# EasyEDA Pro project Hackcard.epro

# Schematic BuisnessCard
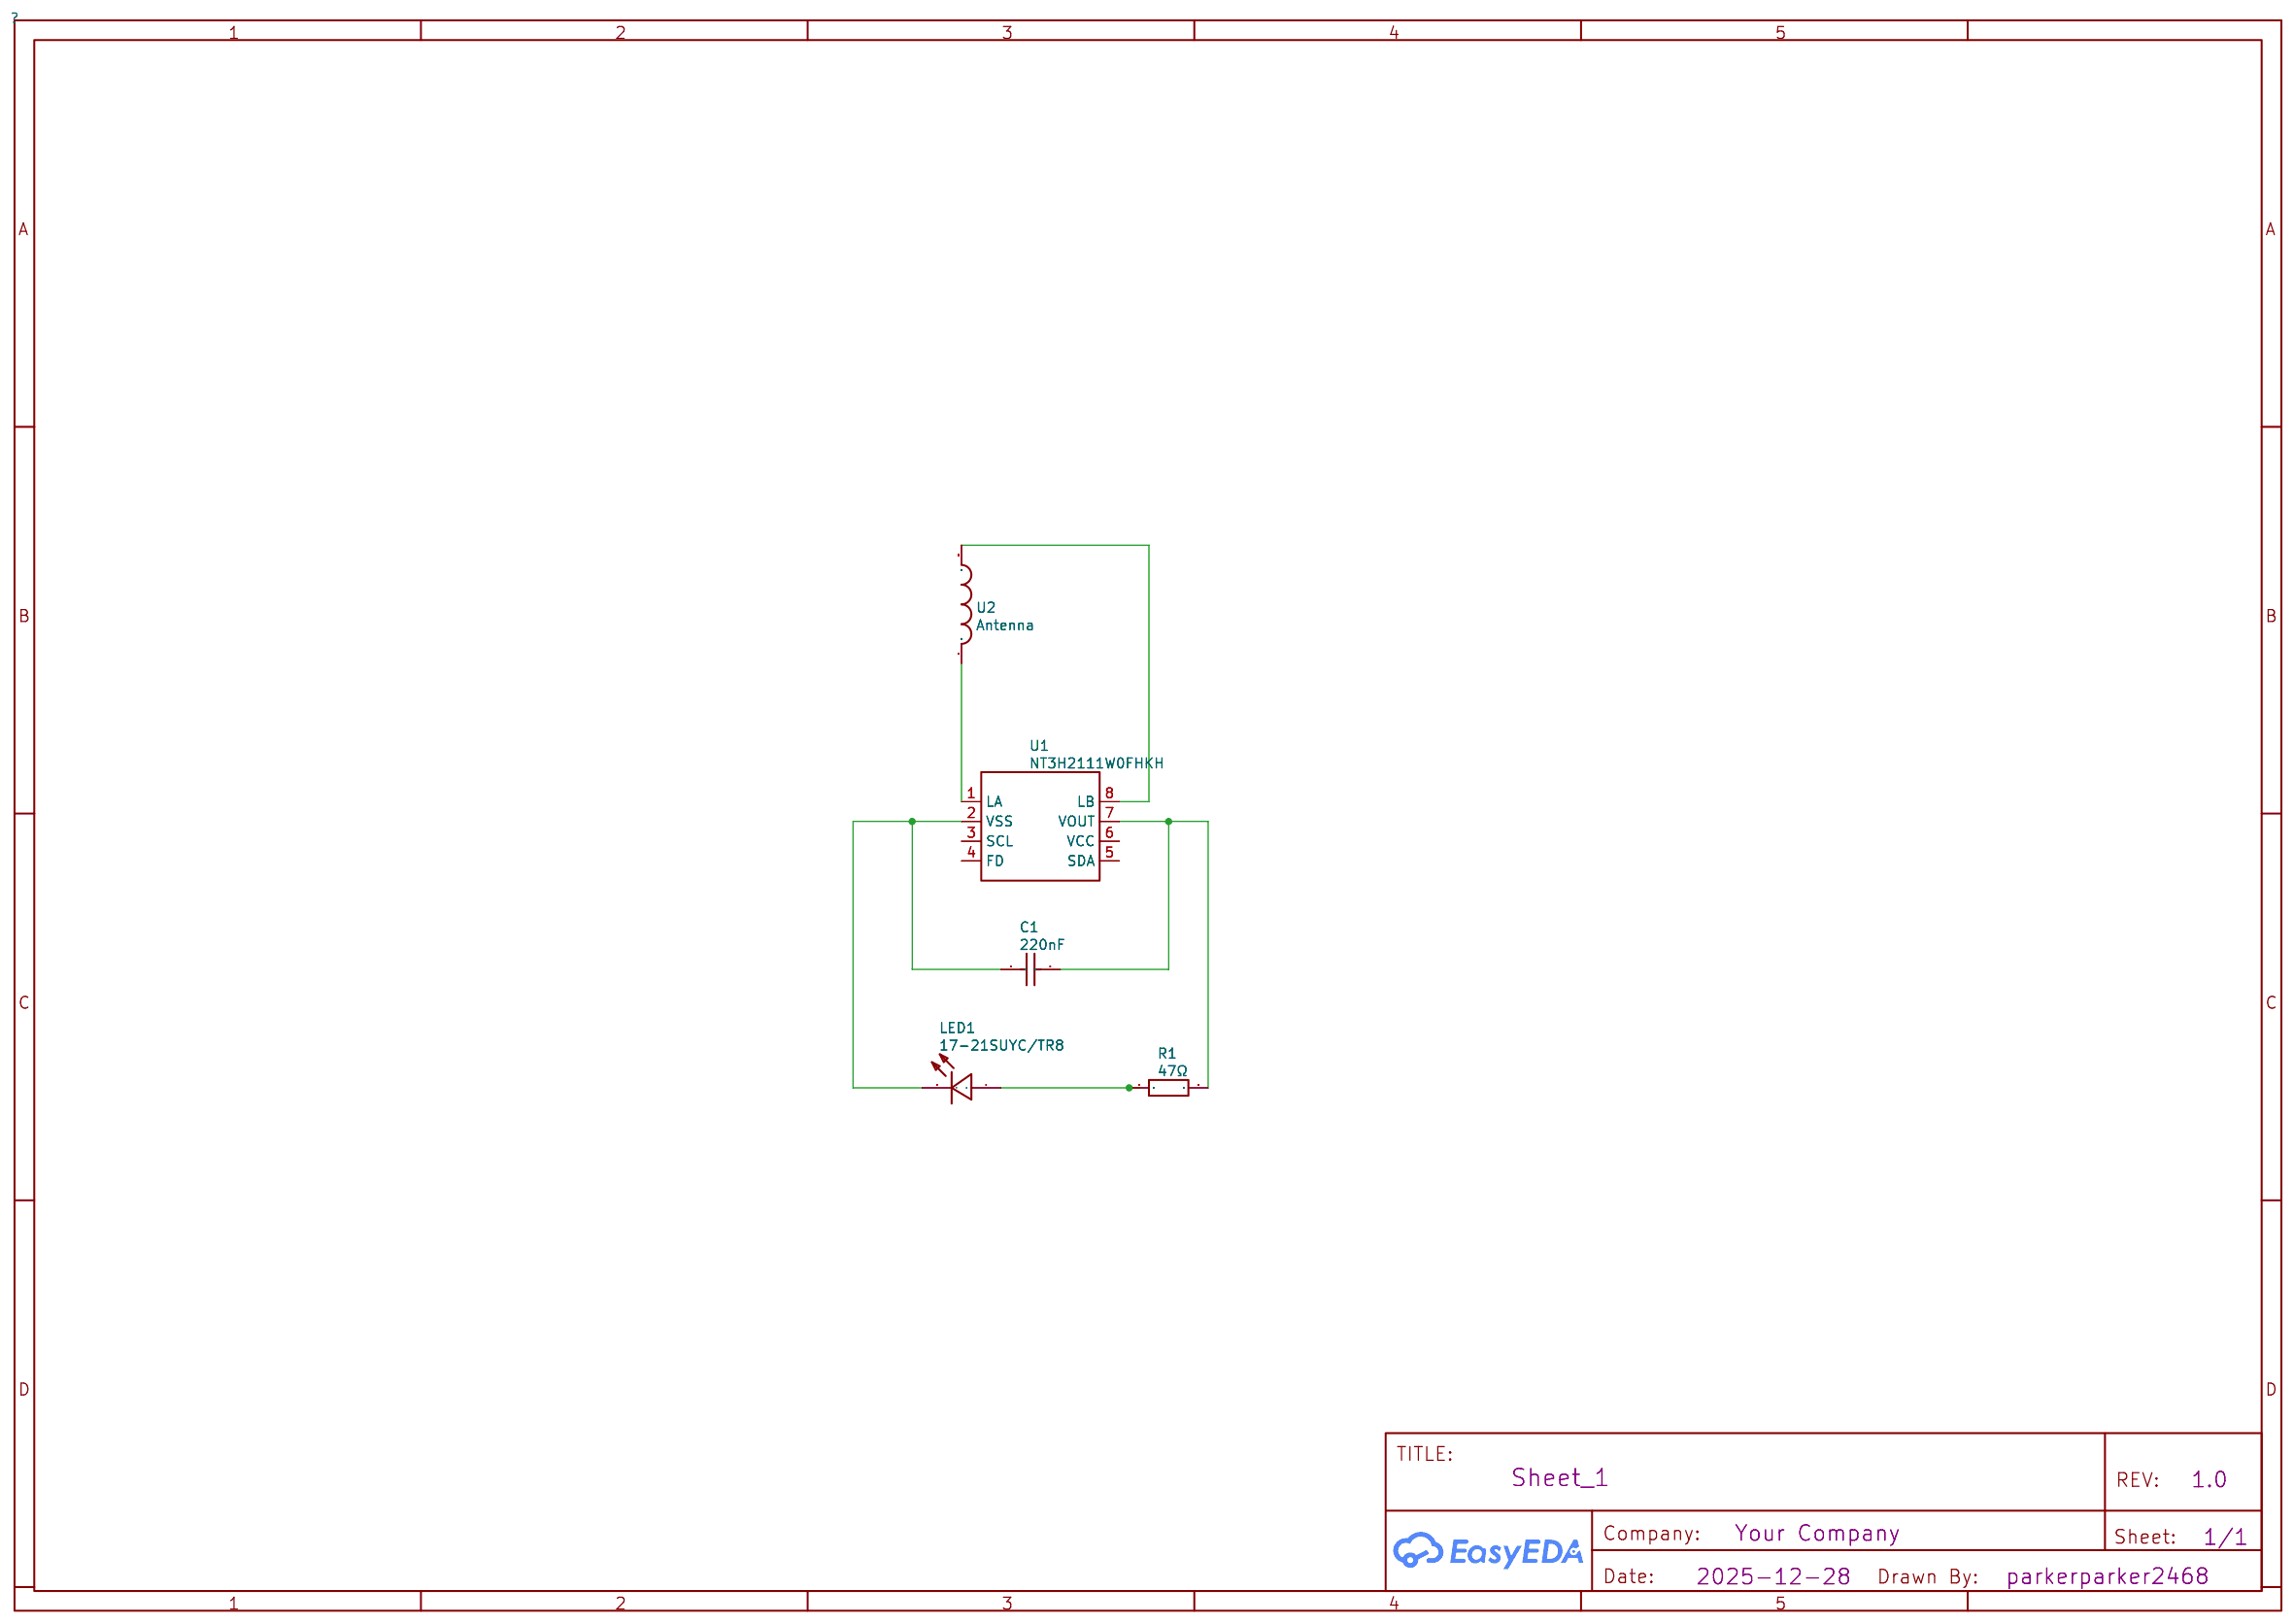
[diagram p0: schematic sheet]

## Parts
C1  220nF  [C0603]
LED1  17-21SUYC/TR8  [LED0805-R-RD]
R1  47Ω  [R0603]
U1  NT3H2111W0FHKH  [XQFN-8_L1.6-W1.6-P0.50-BL_NT3H2111W0FHKH]
U2  Antenna  [25X48MM_NFC_ANTENNA]

## Library data of the parts
C1 = 220nF: Supplier: LCSC; Manufacturer Part: CL10B224KA8NNNC; Manufacturer: SAMSUNG(三星); Supplier Part: C21120; JLCPCB Part Class: Basic Part; nameAlias: Value; spicePre: C; spiceSymbolName: CL10B224KA8NNNC
LED1 = 17-21SUYC/TR8: Supplier: LCSC; Manufacturer: KENTO; Manufacturer Part: KT-0805黄灯; Supplier Part: C2296; JLCPCB Part Class: Basic Part; spicePre: L
R1 = 47Ω: Supplier: LCSC; Manufacturer: UNI-ROYAL(厚声); Manufacturer Part: 0603WAF470JT5E; Supplier Part: C23182; JLCPCB Part Class: Basic Part; nameAlias: Value; spicePre: R; spiceSymbolName: 0603WAF470JT5E
U1 = NT3H2111W0FHKH: Supplier: LCSC; Supplier Part: C710403; Manufacturer: NXP(恩智浦); JLCPCB Part Class: Extended Part; Contributor: LCSC; spicePre: U
U2 = Antenna: Contributor: maggie.j.liu; spicePre: U

## Nets
LED1_1: LED1.1(+) R1.1
U1_1: U1.1(LA) U2.P$1
U1_2: C1.1 LED1.2(-) U1.2(VSS)
U1_7: C1.2 R1.2 U1.7(VOUT)
U1_8: U1.8(LB) U2.P$2

Not connected (* = marked no-connect by the designer): U1 3(SCL) 4(FD) 5(SDA) 6(VCC)

# Board PCB_BuisnessCard
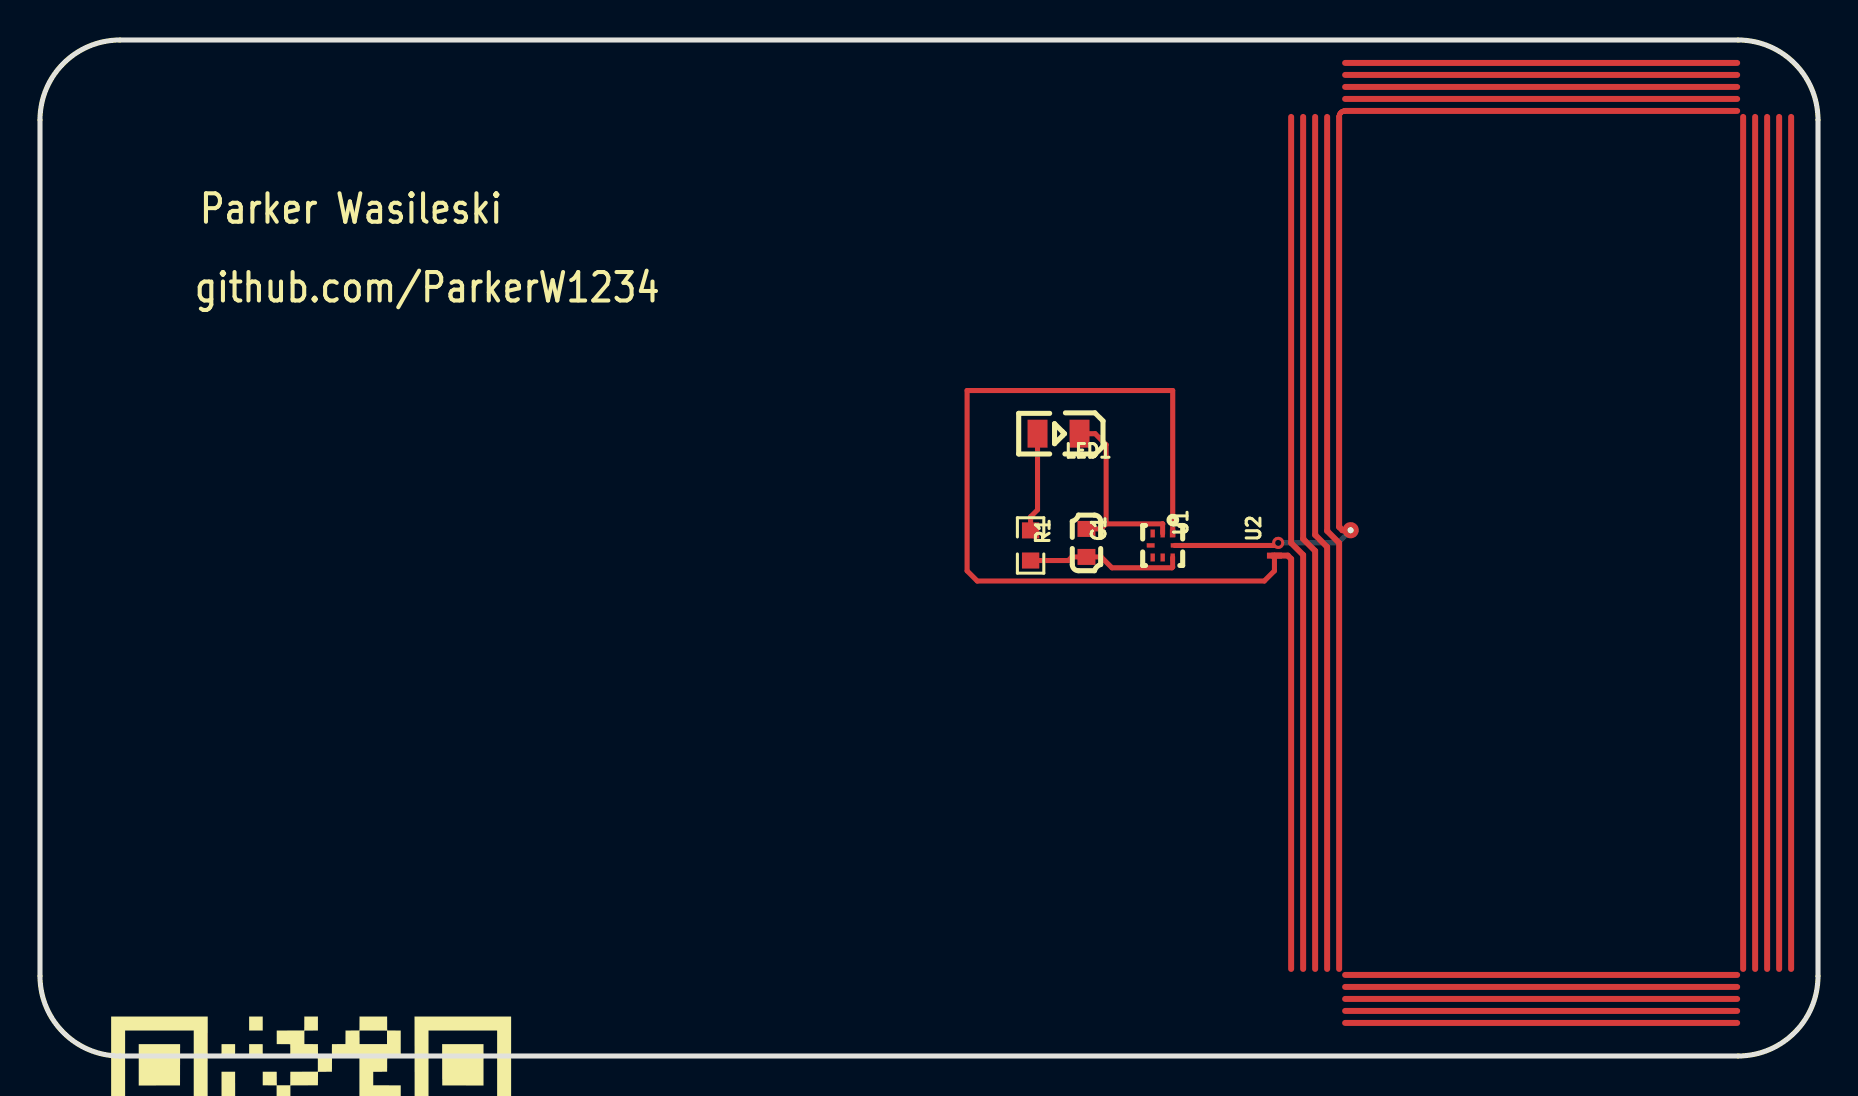
[diagram p1: board, top side]
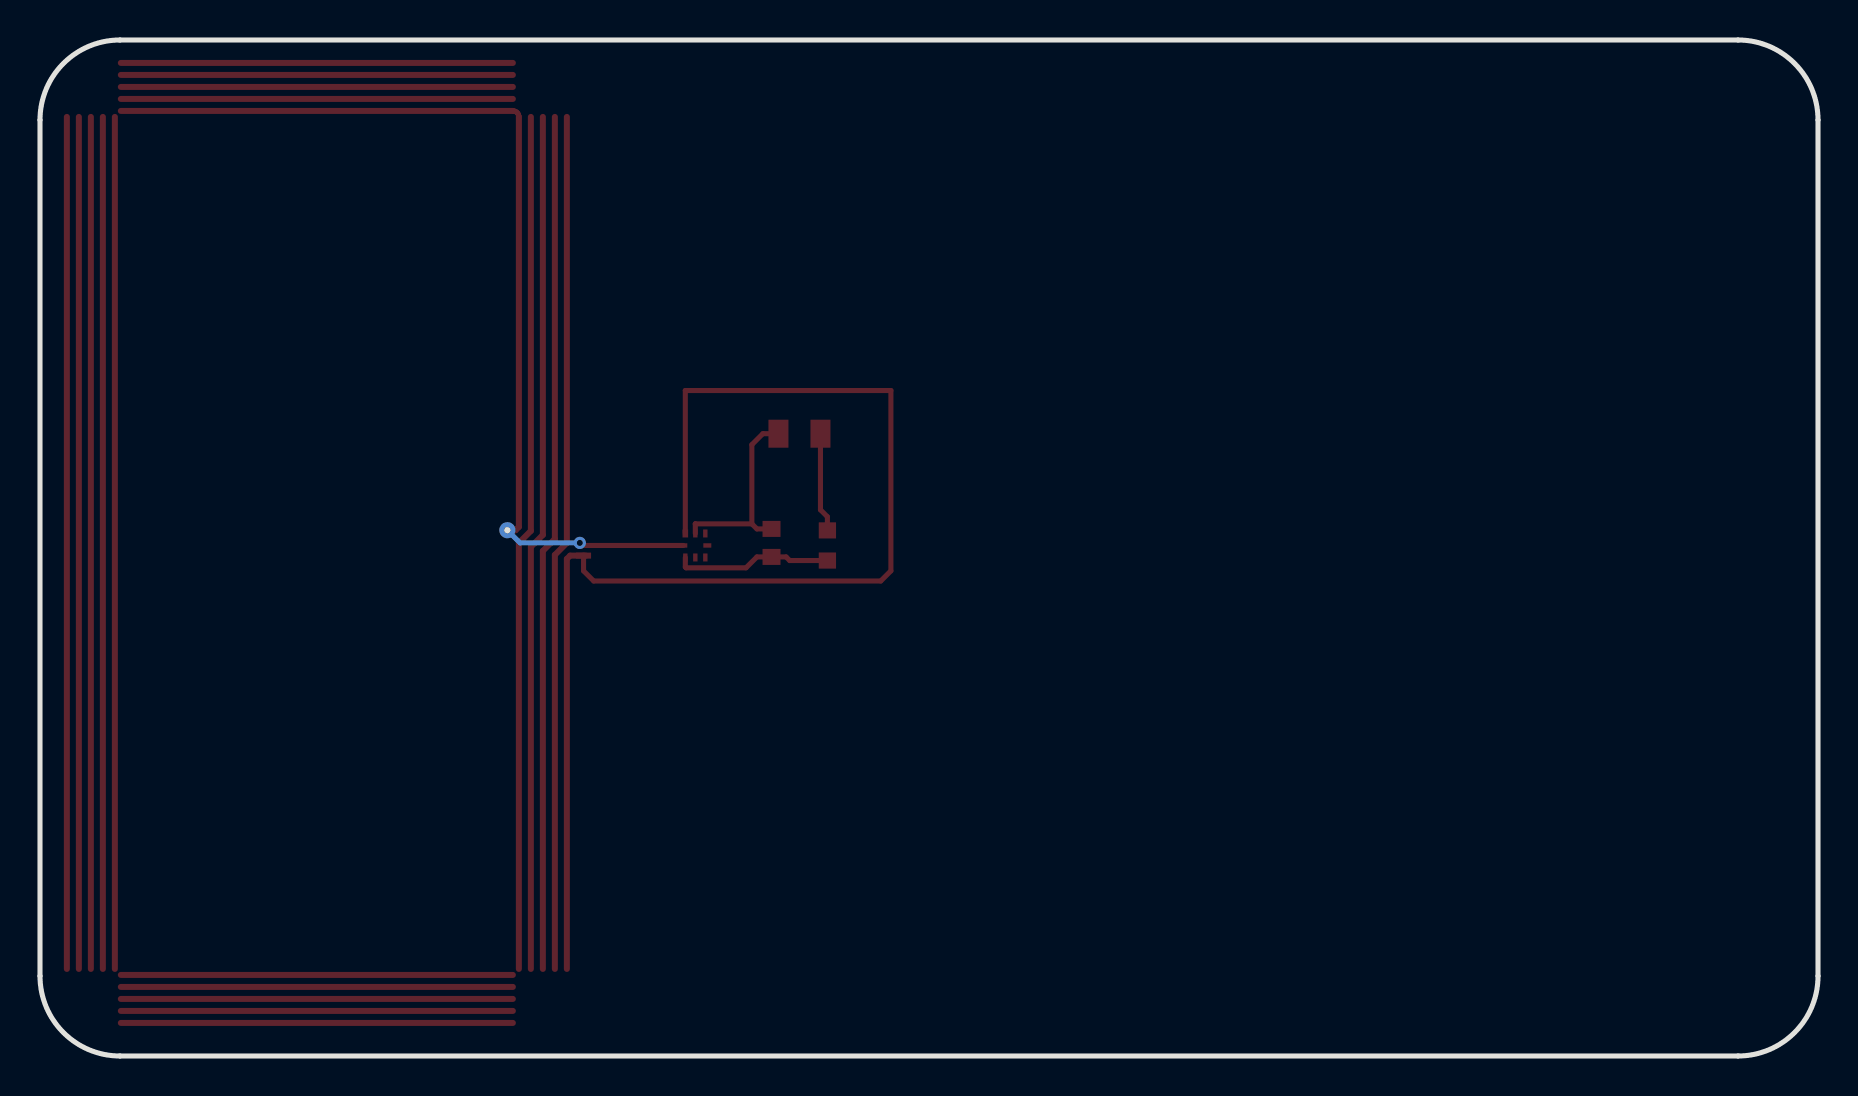
[diagram p2: board, bottom side, seen from below]

Outline 88.9 x 50.8 mm; copper layers: Top Layer, Bottom Layer. Coordinates in mm from the lower left corner of the outline.
Outline path: 0,46.8 arc(1.17,49.63) 4,50.8 84.9,50.8 arc(87.73,49.63) 88.9,46.8 88.9,4 arc(87.73,1.17) 84.9,0 4,0 arc(1.17,1.17) 0,4 0,46.8

## Design rules (mm)
via Default (default): diameter min 0.61, default 0.61, max 100.025; hole min 0.305, default 0.305, max 59.995

## Placement (name value [footprint] x y rotation side)
C1  220nF  [C0603]  52.32 25.65 270 top
LED1  17-21SUYC/TR8  [LED0805-R-RD]  50.93 31.12 180 top
R1  47Ω  [R0603]  49.53 25.53 270 top
U1  NT3H2111W0FHKH  [XQFN-8_L1.6-W1.6-P0.50-BL_NT3H2111W0FHKH]  56.13 25.53 270 top
U2  Antenna  [25X48MM_NFC_ANTENNA]  75.06 25.65 90 top

## Footprints (pads in the part's own frame, mm; a bottom-side part is the same pattern mirrored in y, then rotated)
25X48MM_NFC_ANTENNA
  rect 0.3x0.75 smd: P$1(-0.635,13.335)
  round 0.808 hole 0.3x0.3: P$2(0.635,9.525)
C0603
  rect 0.8x0.9 smd: 1(-0.7,0) 2(0.7,0)
LED0805-R-RD
  rect 1x1.399 smd: 1(1.05,0) 2(-1.05,0)
R0603
  rect 0.806x0.864 smd: 1(-0.753,0) 2(0.753,0)
XQFN-8_L1.6-W1.6-P0.50-BL_NT3H2111W0FHKH
  rect 0.4x0.28 smd: 1(-0.6,0.5)
  rect 0.4x0.22 smd: 2(-0.6,0) 3(-0.6,-0.5) 5(0.6,-0.5) 6(0.6,0) 7(0.6,0.5)
  rect 0.22x0.4 smd: 4(0,-0.6) 8(0,0.6)

## Nets
As in the schematic.

## Via types
v1: diameter 0.61, hole 0.305, Top Layer to Bottom Layer, 1 via

## Routing (per net, layer and track width the routed paths; a pad name or vN(x,y) marks a point on that pad's centre or on a via; arc(x,y) is an arc through that point)
LED1_1: length 5
  Top Layer w0.254: LED1.1 49.88,27.31 49.53,26.96 R1.1
U1_1: length 43
  Top Layer w0.254: 56.63,26.13 56.63,33.27 46.35,33.27 46.35,24.26 46.86,23.75 61.21,23.75 61.72,24.26 U2.P$1
U1_2: length 9.9
  Top Layer w0.254: 53.31,26.61 53.31,30.56 52.76,31.12 LED1.2 ; 53.31,26.61 53.05,26.35 C1.1 ; 53.31,26.61 56.13,26.61 56.13,26.61 U1.2
U1_7: length 7.9
  Top Layer w0.254: R1.2 51.41,24.77 51.59,24.95 C1.2 53.05,24.95 53.6,24.41 56.59,24.41 56.63,24.45 U1.7
U1_8: length 30.7
  Top Layer w0.254: U1.8 61.78,25.53 v1(61.91,25.66) ; 65.26,47.25 65.23,47.25 65.21,47.25 65.18,47.24 65.16,47.24 65.13,47.23 65.11,47.22 65.09,47.2 65.07,47.19 65.05,47.17 65.04,47.16 65.02,47.14 65.01,47.12 64.99,47.1 64.98,47.07 64.97,47.05 64.97,47.03 64.96,47 64.96,46.98 64.96,46.95 64.96,26.45 65.12,26.29 U2.P$2
  Bottom Layer w0.254: v1(61.91,25.66) 64.9,25.66 U2.P$2

## Text on the board
Top Silkscreen Layer: github.com/ParkerW1234 | Parker Wasileski
